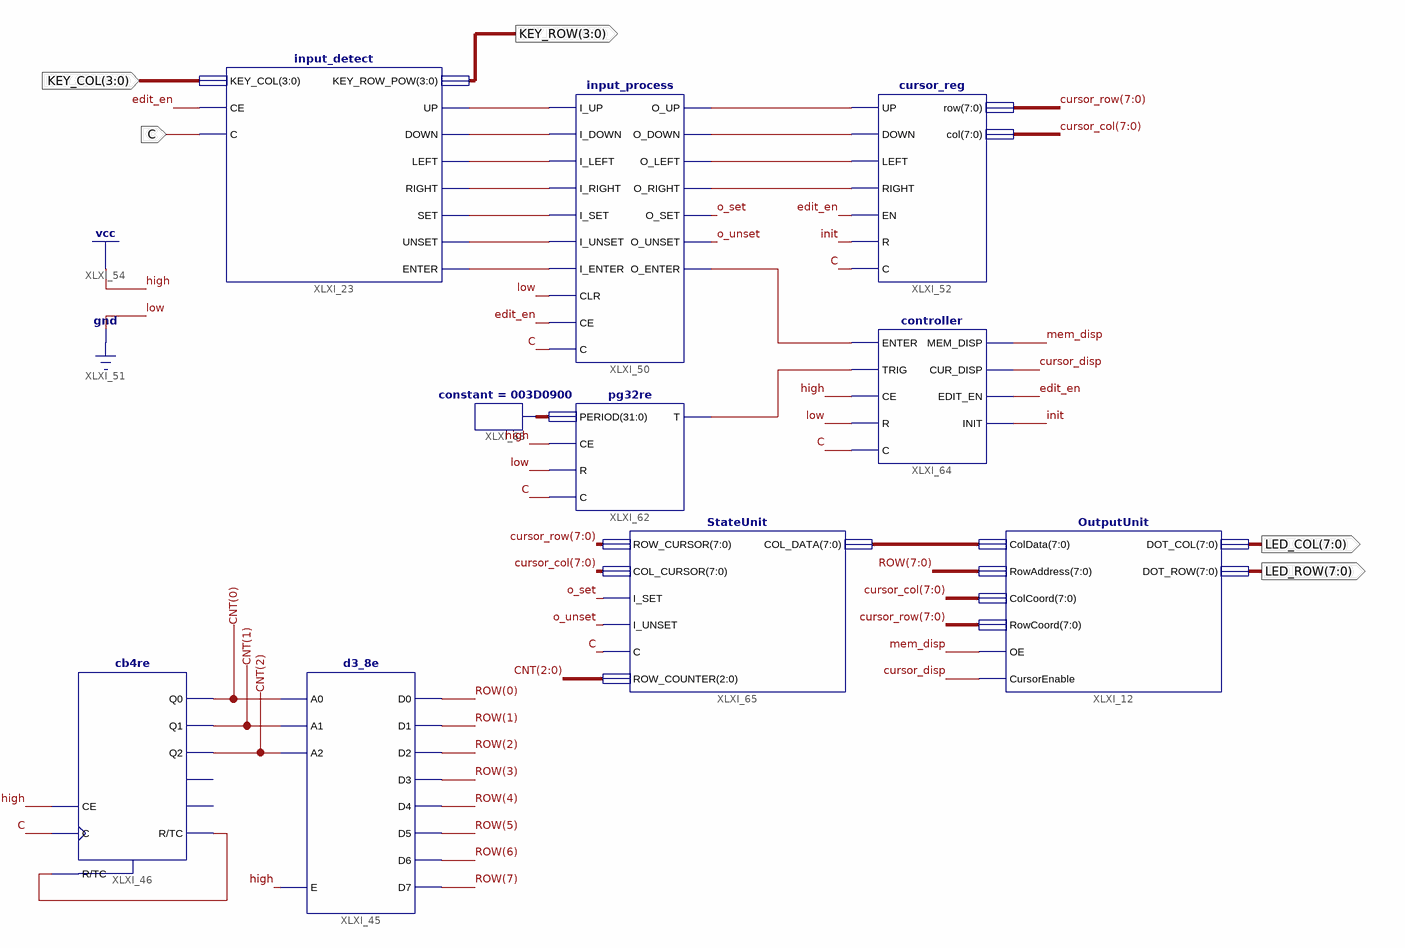
[diagram p0: schematic sheet 1]
// Xilinx ISE schematic top.sch (spartan6) as structural Verilog: 10 symbols, 5 ports
module top (
  input  C,
  input  [3:0] KEY_COL,
  output [3:0] KEY_ROW,
  output [7:0] LED_COL,
  output [7:0] LED_ROW
);

  wire cursor_disp, edit_en, init, mem_disp, o_set, o_unset, XLXN_80, XLXN_81, XLXN_82, XLXN_83, XLXN_110,
       XLXN_132, XLXN_133, XLXN_134, XLXN_136, XLXN_137, XLXN_138, XLXN_139, XLXN_205, XLXN_242;
  wire [2:0] CNT;
  wire [7:0] cursor_col, cursor_row, ROW, XLXN_114;
  wire [31:0] XLXN_209;

  d3_8e XLXI_45 (
    .A0(CNT[0]), .A1(CNT[1]), .A2(CNT[2]), .E(1'b1), .D0(ROW[0]), .D1(ROW[1]), .D2(ROW[2]), .D3(ROW[3]),
    .D4(ROW[4]), .D5(ROW[5]), .D6(ROW[6]), .D7(ROW[7]));
  cb4re XLXI_46 (
    .C(C), .CE(1'b1), .R(XLXN_110), .Q0(CNT[0]), .Q1(CNT[1]), .Q2(CNT[2]), .TC(XLXN_110));  // open: CEO, Q3
  input_detect XLXI_23 (
    .C(C), .CE(edit_en), .DOWN(XLXN_81), .ENTER(XLXN_134), .KEY_COL(KEY_COL), .KEY_ROW_POW(KEY_ROW),
    .LEFT(XLXN_82), .RIGHT(XLXN_83), .SET(XLXN_132), .UNSET(XLXN_133), .UP(XLXN_80));
  cursor_reg XLXI_52 (
    .C(C), .col(cursor_col), .DOWN(XLXN_137), .EN(edit_en), .LEFT(XLXN_138), .R(init), .RIGHT(XLXN_139),
    .row(cursor_row), .UP(XLXN_136));
  input_process XLXI_50 (
    .C(C), .CE(edit_en), .CLR(1'b0), .I_DOWN(XLXN_81), .I_ENTER(XLXN_134), .I_LEFT(XLXN_82),
    .I_RIGHT(XLXN_83), .I_SET(XLXN_132), .I_UNSET(XLXN_133), .I_UP(XLXN_80), .O_DOWN(XLXN_137),
    .O_ENTER(XLXN_242), .O_LEFT(XLXN_138), .O_RIGHT(XLXN_139), .O_SET(o_set), .O_UNSET(o_unset),
    .O_UP(XLXN_136));
  pg32re XLXI_62 (.C(C), .CE(1'b1), .PERIOD(XLXN_209), .R(1'b0), .T(XLXN_205));
  constant #(.CValue("003D0900")) XLXI_63 (.O(XLXN_209));
  controller XLXI_64 (
    .C(C), .CE(1'b1), .CUR_DISP(cursor_disp), .EDIT_EN(edit_en), .ENTER(XLXN_242), .INIT(init),
    .MEM_DISP(mem_disp), .R(1'b0), .TRIG(XLXN_205));
  StateUnit XLXI_65 (
    .C(C), .COL_CURSOR(cursor_col), .COL_DATA(XLXN_114), .I_SET(o_set), .I_UNSET(o_unset), .ROW_COUNTER(CNT),
    .ROW_CURSOR(cursor_row));
  OutputUnit XLXI_12 (
    .ColCoord(cursor_col), .ColData(XLXN_114), .CursorEnable(cursor_disp), .DOT_COL(LED_COL),
    .DOT_ROW(LED_ROW), .OE(mem_disp), .RowAddress(ROW), .RowCoord(cursor_row));
endmodule
